# EAGLE design TinyNES_Controller_Port (EAGLE 9.6.2)
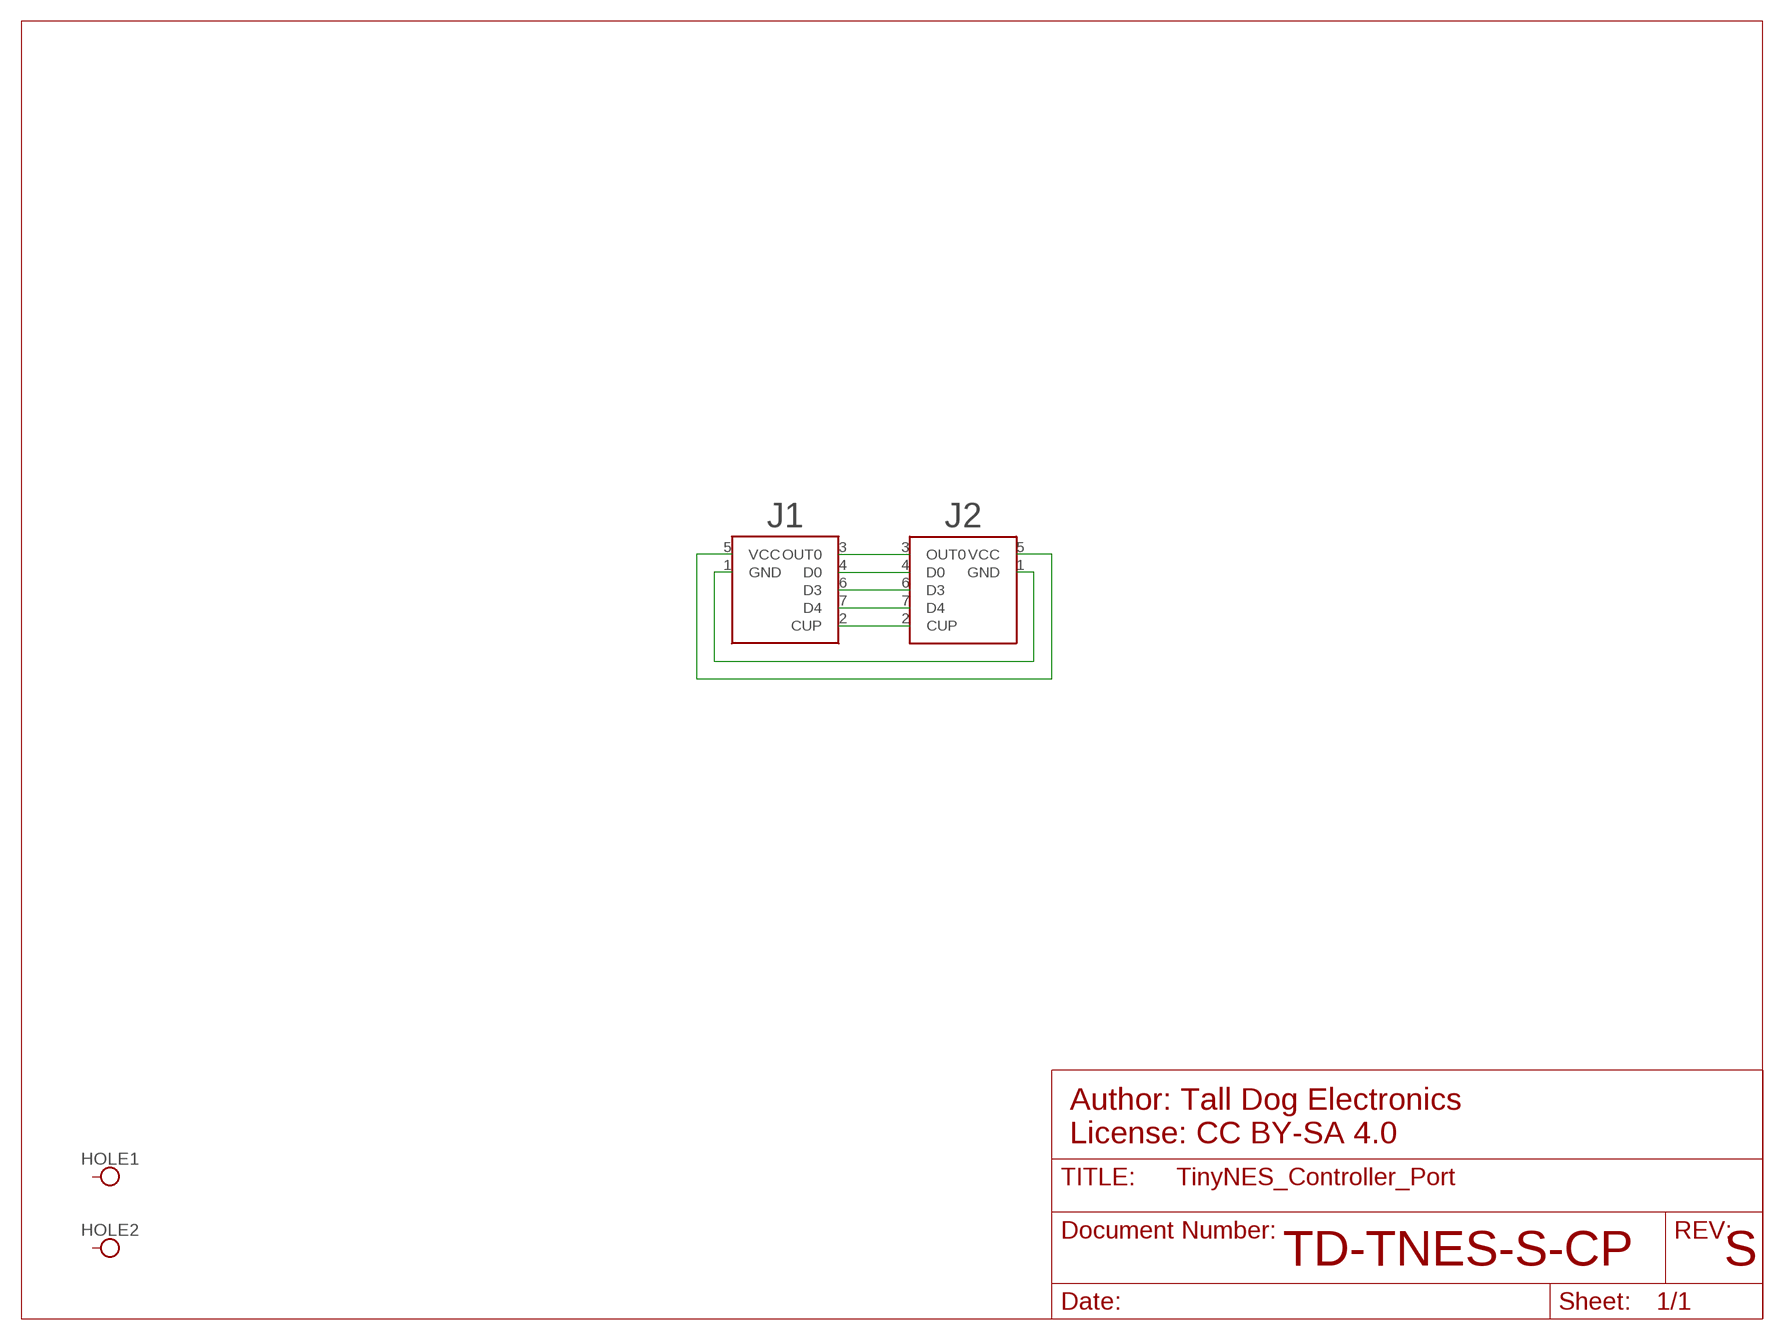
[diagram p0: schematic, sheet 1]

## Parts
HOLE1  HOLE-M2.5  [HOLE-M2.5]
HOLE2  HOLE-M2.5  [HOLE-M2.5]
J1  CTRL  [JST-PH-7]
J2  CTRL-NES  [NES-CTRL]

## Nets
CUP: J1.2(CUP) J2.2(CUP)
D0: J1.4(D0) J2.4(D0)
D3: J1.6(D3) J2.6(D3)
D4: J1.7(D4) J2.7(D4)
GND: J1.1(GND) J2.1(GND)
OUT0: J1.3(OUT0) J2.3(OUT0)
VCC: J1.5(VCC) J2.5(VCC)
Unconnected: HOLE1.P$1 HOLE1.P$6 HOLE1.P$7 HOLE1.P$8 HOLE1.P$9 HOLE1.P$13 HOLE1.P$14 HOLE1.P$15 HOLE1.P$16 HOLE2.P$1 HOLE2.P$6 HOLE2.P$7 HOLE2.P$8 HOLE2.P$9 HOLE2.P$13 HOLE2.P$14 HOLE2.P$15 HOLE2.P$16

## Notes on the sheet
- Author: Tall Dog Electronics
  License: CC BY-SA 4.0
- TD-TNES-S-CP | S

## Library data of the parts
HOLE1 HOLE2 = TinyNES_Library:HOLE
J1 J2 = TinyNES_Library:CTRL

## Board
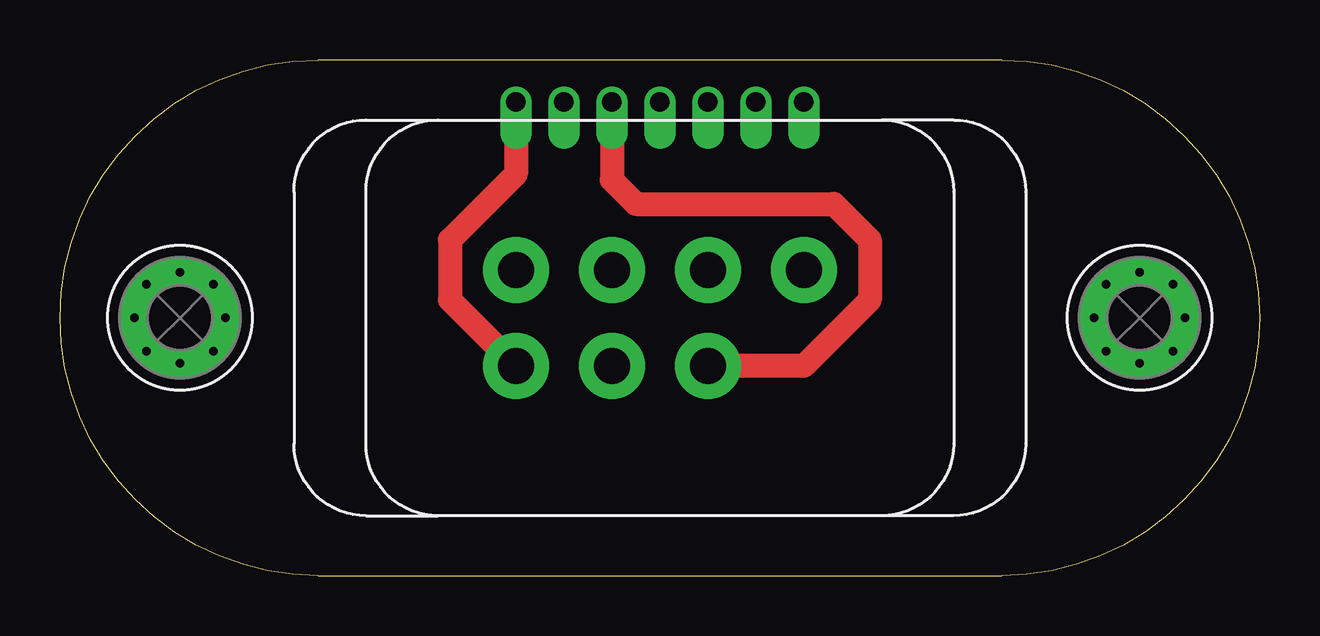
[diagram p1: board, top side]
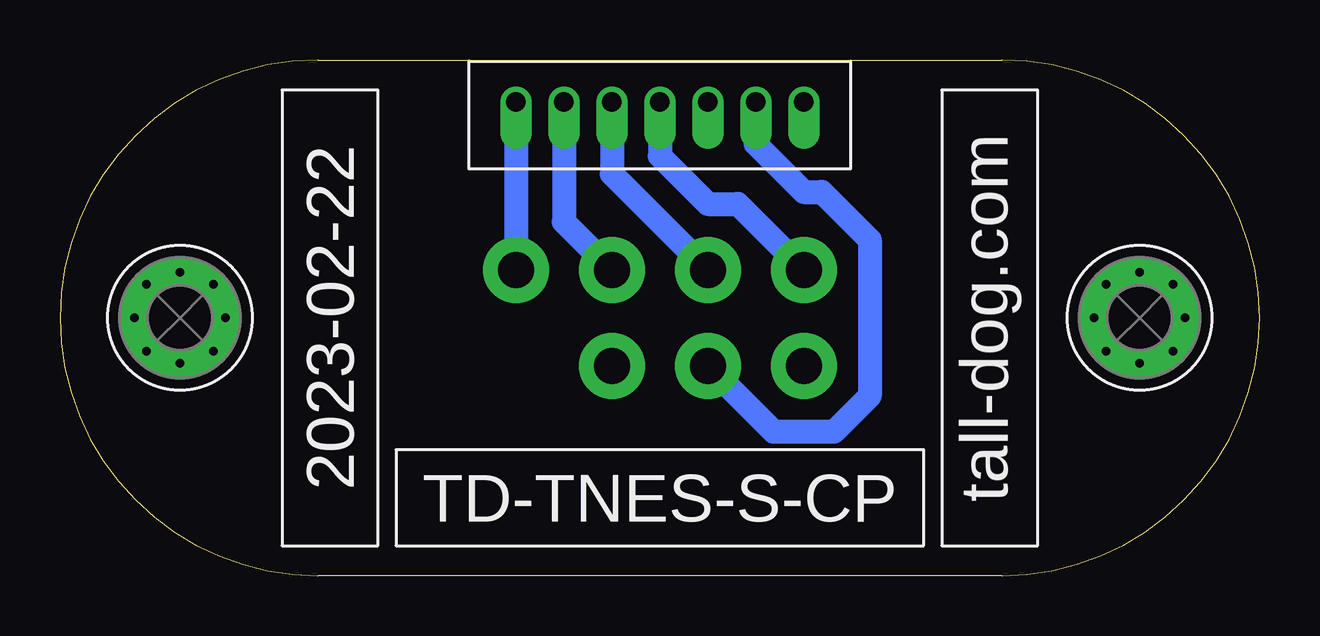
[diagram p2: board, bottom side, seen from below]

Size 50 x 21.5 mm. Coordinates in mm from the lower left corner, seen from the top.
Outline: 10.75,0 39.25,0 arc180 39.25,21.5 10.75,21.5 arc180 10.75,0
Copper layers (1*16): Top 0.035mm / dielectric 1.5mm / Bottom 0.035mm
Design rules "default *": minimum track width 6mil, minimum drill 0.3mm, track to track 6mil, track to pad 6mil, pad to pad 6mil, via to via 6mil, smd to smd 6mil, copper to edge 40mil, drill to drill 6mil, minimum pad ring 10mil, minimum via ring 8mil, stop-mask expansion 0mil, vias tented up to drill 0mil, thermal gap 10mil

### Footprints (pad centres in the part's own frame; a part is rotated, then mirrored left to right if it is on the bottom)
HOLE-M2.5 = drill 2.7 pad 5: P$1 0,0 | drill 0.35: P$6 1.4,1.4; P$7 1.9,0; P$8 1.4,-1.4; P$9 -1.4,-1.4; P$13 0,-1.9; P$14 -1.4,1.4; P$15 -1.9,0; P$16 0,1.9
JST-PH-7 = drill 0.8 pad 1.2 offset: 1 6,0; 2 4,0; 3 2,0; 4 0,0; 5 -2,0; 6 -4,0; 7 -6,0
NES-CTRL = drill 1.5 pad 2.75: 1 6,2; 2 2,2; 3 -2,2; 4 -6,2; 5 2,-2; 6 -2,-2; 7 -6,-2

### Placement (x,y rotation side)
HOLE1  5,10.75 0 top
HOLE2  45,10.75 0 top
J1  25,19.75 180 bottom
J2  25,10.75 0 top

### Tracks (layer width: path | path; a pad name or v marks a point on that pad's centre or on a via)
CUP
  Bottom 1: J1.2 29,14.75 J2.2
D0
  Bottom 1: J1.4 25,17.5 23,15.5 21.75,15.5 J2.4
D3
  Bottom 1: J1.6 21,18 19,16 18.25,16 16.25,14 16.25,7.5 17.75,6 20.25,6 J2.6
D4
  Top 1: J2.7 16.25,11.5 16.25,14 19,16.75 J1.7
GND
  Bottom 1: J1.1 J2.1
OUT0
  Bottom 1: J1.3 27,16.75 J2.3
VCC
  Top 1: J1.5 23,16.5 24,15.5 32.25,15.5 33.75,14 33.75,11.5 31,8.75 J2.5

### Text on the board
bPlace: tall-dog.com | 2023-02-22 | TD-TNES-S-CP